# EAGLE design eye_of_horus_v1 (EAGLE 7.2.0)
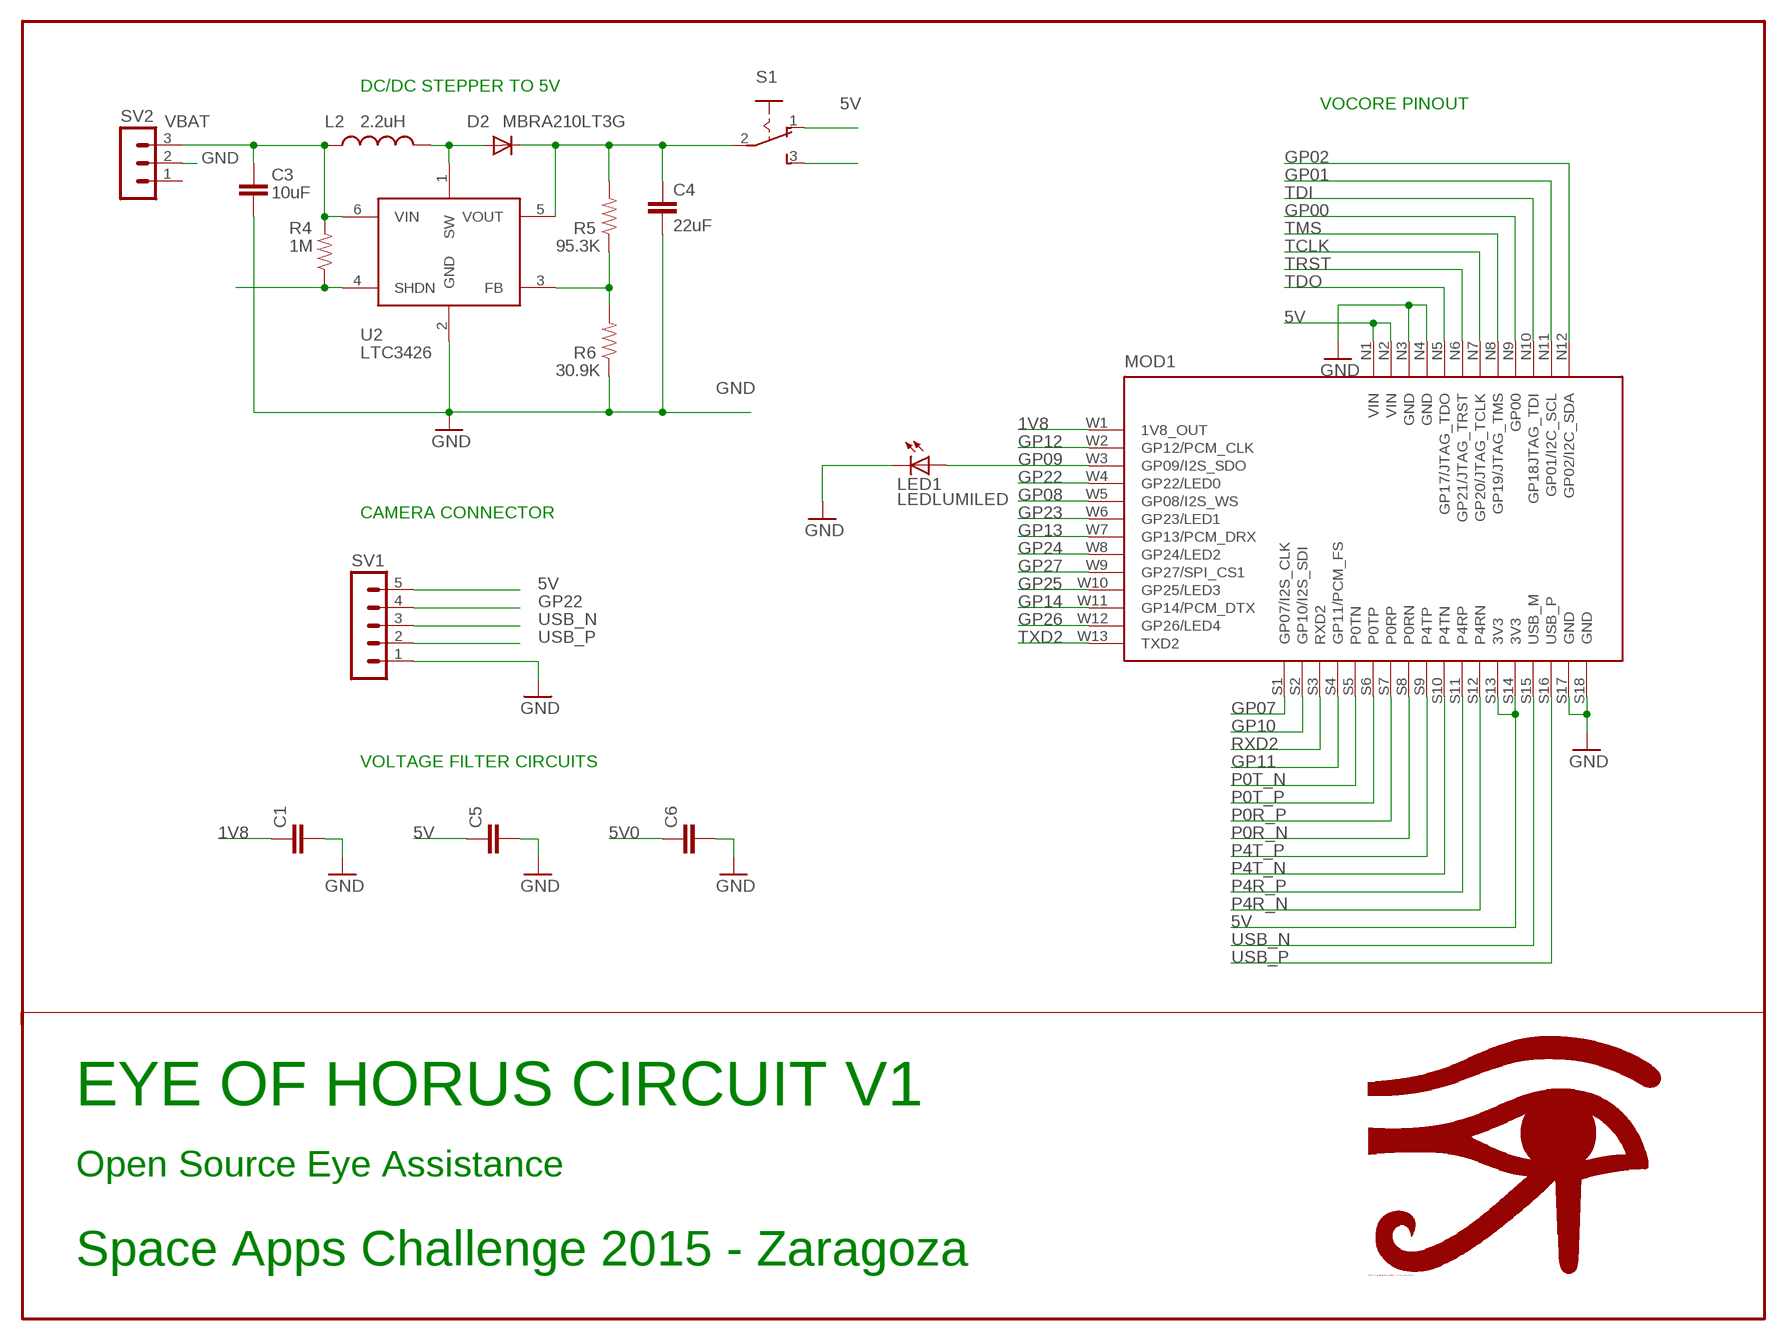
[diagram p0: schematic, sheet 1]

## Parts
C1  C-EUC0805  [C0805]
C3  10uF  CAP0603  [0603]
C4  22uF  CAP1206  [1206]
C5  C-EUC0805  [C0805]
C6  C-EUC0805  [C0805]
D2  MBRA210LT3G  DIODESMA  [SMA-DIODE]
L2  2.2uH  INDUCTOR1313  [1_3X1_3]
LED1  LEDLUMILED  [LUMILED]
MOD1  VOCORE_V10A  [VOCORE_V10A]
R4  1M  RESISTOR0603  [0603]
R5  95.3K  RESISTOR0603  [0603]
R6  30.9K  RESISTOR0603  [0603]
S1  255SB  [255SB]
SV1  MA05-1  [MA05-1]
SV2  MA03-1  [MA03-1]
U2  LTC3426  [SOT23-6]

## Nets
1V8: C1.1 MOD1.W1(1V8_OUT)
5V: C5.1 MOD1.N1(VIN) MOD1.N2(VIN) MOD1.S13(3V3) MOD1.S14(3V3) S1.1(O) SV1.5
5V0: C6.1
GND: C1.2 C3.2 C4.2 C5.2 C6.2 LED1.4-(C) MOD1.N3(GND) MOD1.N4(GND) MOD1.S17(GND) MOD1.S18(GND) R6.1 SV1.1 SV2.2 U2.2(GND)
GP00: MOD1.N9(GP00)
GP01: MOD1.N11(GP01/I2C_SCL)
GP02: MOD1.N12(GP02/I2C_SDA)
GP07: MOD1.S1(GP07/I2S_CLK)
GP08: MOD1.W5(GP08/I2S_WS)
GP09: LED1.2+(A) MOD1.W3(GP09/I2S_SDO)
GP10: MOD1.S2(GP10/I2S_SDI)
GP11: MOD1.S4(GP11/PCM_FS)
GP12: MOD1.W2(GP12/PCM_CLK)
GP13: MOD1.W7(GP13/PCM_DRX)
GP14: MOD1.W11(GP14/PCM_DTX)
GP22: MOD1.W4(GP22/LED0) SV1.4
GP23: MOD1.W6(GP23/LED1)
GP24: MOD1.W8(GP24/LED2)
GP25: MOD1.W10(GP25/LED3)
GP26: MOD1.W12(GP26/LED4)
GP27: MOD1.W9(GP27/SPI_CS1)
N$1: D2.A L2.P$2 U2.1(SW)
N$2: R4.1 U2.4(SHDN)
N$3: C4.1 D2.C R5.2 S1.2(P) U2.5(VOUT)
N$4: R5.1 R6.2 U2.3(FB)
N$6: S1.3(S)
P0R_N: MOD1.S8(P0RN)
P0R_P: MOD1.S7(P0RP)
P0T_N: MOD1.S5(P0TN)
P0T_P: MOD1.S6(P0TP)
P4R_N: MOD1.S12(P4RN)
P4R_P: MOD1.S11(P4RP)
P4T_N: MOD1.S10(P4TN)
P4T_P: MOD1.S9(P4TP)
RXD2: MOD1.S3(RXD2)
TCLK: MOD1.N7(GP20/JTAG_TCLK)
TDI: MOD1.N10(GP18JTAG_TDI)
TDO: MOD1.N5(GP17/JTAG_TDO)
TMS: MOD1.N8(GP19/JTAG_TMS)
TRST: MOD1.N6(GP21/JTAG_TRST)
TXD2: MOD1.W13(TXD2)
USB_N: MOD1.S15(USB_M) SV1.3
USB_P: MOD1.S16(USB_P) SV1.2
VBAT: C3.1 L2.P$1 R4.2 SV2.3 U2.6(VIN)
Unconnected: SV2.1

## Notes on the sheet
- DC/DC STEPPER TO 5V
- VOCORE PINOUT
- CAMERA CONNECTOR
- VOLTAGE FILTER CIRCUITS
- EYE OF HORUS CIRCUIT V1
- Open Source Eye Assistance
- Space Apps Challenge 2015 - Zaragoza
- C:/Users/Luis Martín/Desktop/Eye_of_horus_gold_(1).bmp

## Library data of the parts
C1 C5 C6 = rcl:C-EU: CAPACITOR, European symbol
C3 C4 = CH_passive:CAP: Capacitor Standard 0603 ceramic capacitor, and 0.1" leaded capacitor.
D2 = CH_semiconductors:DIODE: Diode These are standard reverse protection diodes and small signal diodes. SMA package can handle up to about 1A. SOD-323 can handle about 200mA. What the SOD-323 package when ordering, there are some mfgs out there that are 5-pin packages.
L2 = CH_passive:INDUCTOR: Inductors Basic Inductor/Choke - 0603 and 1206. Footprints are not proven and vary greatly between part numbers.
LED1 = led-lumiled:LED: LED - LUMILED® LXK2-PW12-R00, LXK2-PW12-S00, LXK2-PW14-U00, LXK2-PW14-V00 LXK2-PM12-R00, LXK2-PM12-S00, LXK2-PM14-U00 LXK2-PE12-Q00, LXK2-PE12-R00, LXK2-PE12-S00, LXK2-PE14-T00, LXK2-PE14-U00 LXK2-PB12-K00, LXK2-PB12-L00, LXK2-PB12-M00, LXK2-PB14-N00, LXK2-PB14-P00, LXK2-PB14-Q00 LXK2-PR12-L00, LXK2-PR12-M00, LXK2-PR14-Q00, LXK2-PR14-R00 LXK2-PD12-Q00, LXK2-PD12-R00, LXK2-PD12-S00 LXK2-PH12-R00, LXK2-PH12-S00 LXK2-PL12-P00, LXK2-PL12-Q00, LXK2-PL12-R00 Source: www.luxeon.com; OC_FARNELL: unknown; OC_NEWARK: unknown
MOD1 = vocore:VOCORE_V10A: VoCore module footprint, revision 1.0a Based on: http://vonger.cn/wp-content/uploads/2014/06/VoCore.v1.0a.pcb_.pdf Found a bug? Get in touch or send a pull request at https://github.com/omerk/vocore-evk
R4-R6 = CH_passive:RESISTOR: Resistor Basic schematic elements and footprints for 0603, 1206, and PTH 1/10th watt (small) resistors.
S1 = switch:255SB: SLIDING SWITCH Distributor Buerklin, 11G810
SV1 = con-lstb:MA05-1: PIN HEADER; OC_FARNELL: unknown; OC_NEWARK: unknown
SV2 = con-lstb:MA03-1: PIN HEADER; OC_FARNELL: unknown; OC_NEWARK: unknown
U2 = CH_Linear_technology:LTC3426

## Board
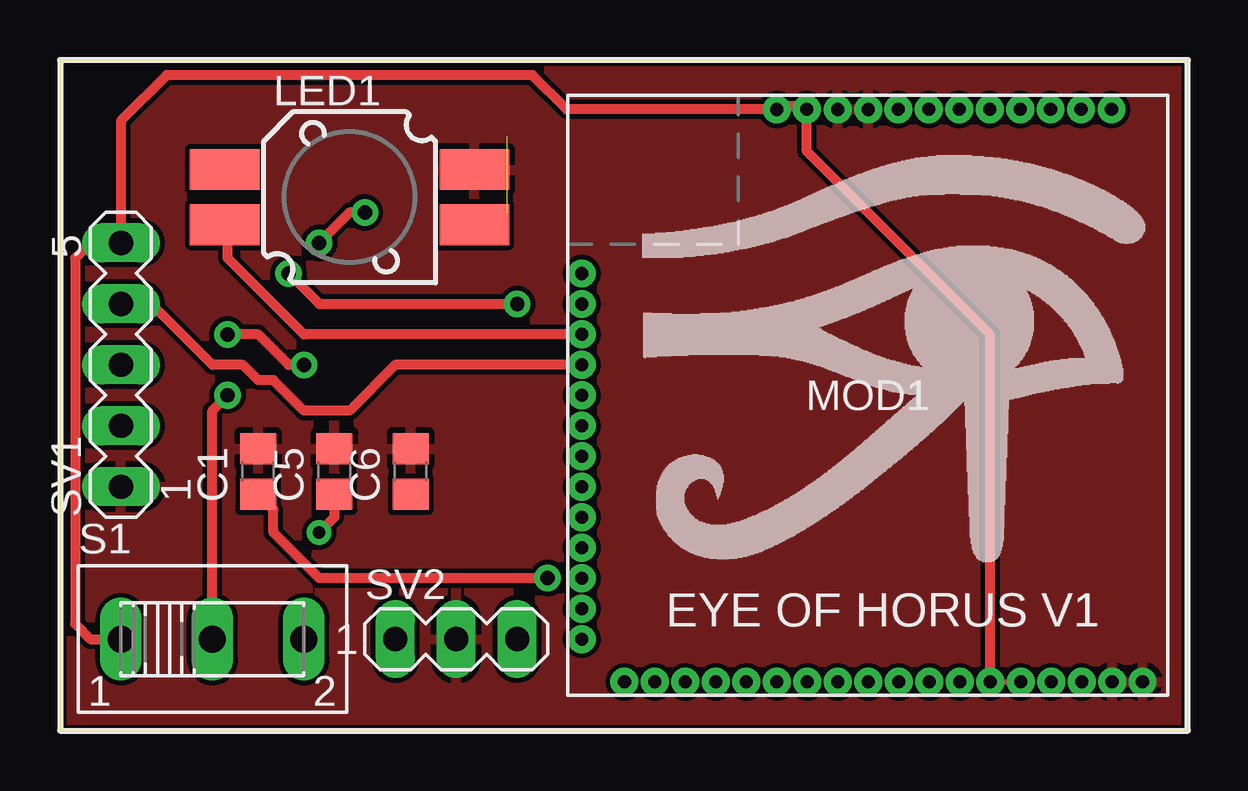
[diagram p1: board, top side]
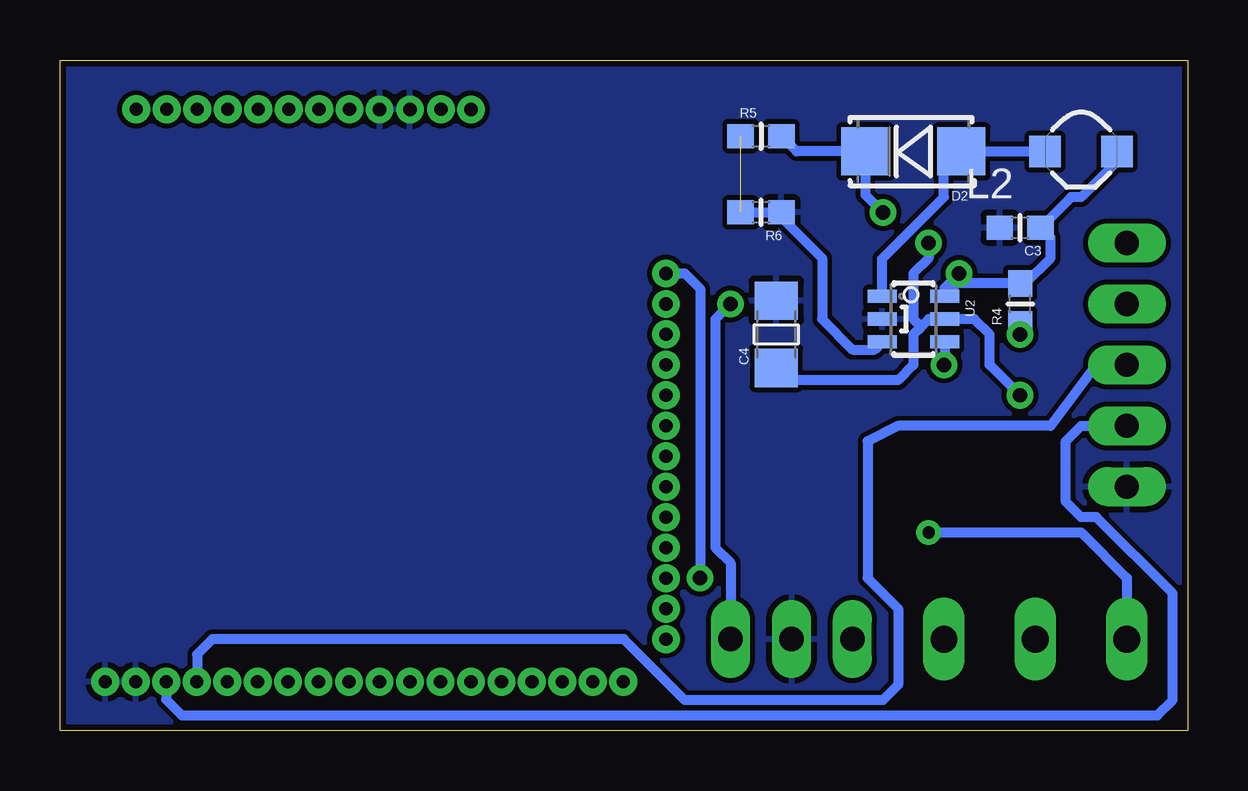
[diagram p2: board, bottom side, seen from below]

Size 46.99 x 27.94 mm. Coordinates in mm from the lower left corner, seen from the top.
Outline: 0,0 46.99,0 46.99,27.94 0,27.94 0,0
Copper layers (1*16): Top 0.035mm / dielectric 1.5mm / Bottom 0.035mm
Design rules "CHome": minimum track width 8mil, minimum drill 20mil, track to track 8mil, track to pad 8mil, pad to pad 8mil, via to via 8mil, smd to smd 8mil, copper to edge 10mil, drill to drill 8mil, minimum pad ring 12mil, minimum via ring 10mil, stop-mask expansion 4mil, vias tented up to drill 25mil, thermal gap 10mil

### Footprints (pad centres in the part's own frame; a part is rotated, then mirrored left to right if it is on the bottom)
C0805 = smd 1.3 x 1.5: 1 -0.95,0; 2 0.95,0
0603 = smd 1.1 x 1: 1 -0.85,0; 2 0.85,0
1206 = smd 1.6 x 1.8: 1 -1.4,0; 2 1.4,0
SMA-DIODE = smd 2 x 2: A -2,0; C 2,0
1_3X1_3 = smd 1.3 x 1.3: P$1 -1.5,0; P$2 1.5,0
LUMILED = smd 2.9 x 1.7: 1NC -5.2,1.15; 2+ -5.2,-1.15; 3NC 5.2,-1.15; 4- 5.2,1.15
VOCORE_V10A = drill 0.55 pad 0.906: N1 -3.788,11.909; N2 -2.541,11.912; N3 -1.248,11.909; N4 0.022,11.909; N5 1.269,11.912; N6 2.539,11.912; N7 3.809,11.912; N8 5.079,11.912; N9 6.349,11.912; N10 7.619,11.912; N11 8.889,11.912; N12 10.159,11.912; S1 -10.138,-11.941; S2 -8.868,-11.941; S3 -7.598,-11.941; S4 -6.328,-11.941; S5 -5.058,-11.941; S6 -3.788,-11.941; S7 -2.518,-11.941; S8 -1.248,-11.941; S9 0.022,-11.941; S10 1.292,-11.941; S11 2.562,-11.941; S12 3.832,-11.941; S13 5.102,-11.941; S14 6.372,-11.941; S15 7.642,-11.941; S16 8.912,-11.941; S17 10.182,-11.941; S18 11.452,-11.941; W1 -11.916,5.077; W2 -11.916,3.807; W3 -11.916,2.537; W4 -11.916,1.267; W5 -11.916,-0.003; W6 -11.916,-1.273; W7 -11.916,-2.543; W8 -11.916,-3.813; W9 -11.916,-5.083; W10 -11.916,-6.353; W11 -11.916,-7.623; W12 -11.916,-8.893; W13 -11.916,-10.163
255SB = drill 1.118 long: 1 -3.81,0; 2 0,0; 3 3.81,0
MA05-1 = drill 1.016 long: 1 -5.08,0; 2 -2.54,0; 3 0,0; 4 2.54,0; 5 5.08,0
MA03-1 = drill 1.016 long: 1 -2.54,0; 2 0,0; 3 2.54,0
SOT23-6 = smd 0.55 x 1.2: 1 -0.95,-1.3; 2 0,-1.3; 3 0.95,-1.3; 4 0.95,1.3; 5 0,1.3; 6 -0.95,1.3

### Placement (x,y rotation side)
C1  8.26,10.79 90 top
C3  6.98,20.96 180 bottom
C4  17.15,16.51 90 bottom
C5  11.43,10.79 90 top
C6  14.61,10.79 90 top
D2  11.43,24.13 180 bottom
L2  4.45,24.13 180 bottom
LED1  12.07,22.22 0 top
MOD1  33.66,13.97 0 top
R4  6.98,17.78 90 bottom
R5  17.78,24.77 0 bottom
R6  17.78,21.59 180 bottom
S1  6.35,3.81 0 top
SV1  2.54,15.24 90 top
SV2  16.51,3.81 0 top
U2  11.43,17.14 270 bottom

### Tracks (layer width: path | path; a pad name or v marks a point on that pad's centre or on a via)
1V8  (via drill 0.6)
  Top 0.406: v20.32,6.35 10.8,6.35 8.89,8.25 8.89,9.21 C1.1
  Bottom 0.406: MOD1.W1 20.95,19.05 20.32,18.41 v20.32,6.35
5V  (via drill 0.51)
  Top 0.203: MOD1.S13 MOD1.S14
  Top 0.406: S1.1 1.27,3.81 0.64,4.44 0.64,19.68 1.27,20.32 SV1.5 2.54,25.4 4.45,27.3 19.69,27.3 21.11,25.88 MOD1.N1 29.85,25.88 29.85,26.03 31.11,26.03 MOD1.N2 31.12,24.13 38.76,16.49 MOD1.S13 | C5.1 11.43,8.89 v10.8,8.25
  Bottom 0.406: v10.8,8.25 4.45,8.25 2.54,6.35 S1.1
GND
  pour Bottom: -0.63,28.57 -0.63,-0.63 47.63,-0.63 47.63,28.57
  pour Top: -0.63,-0.63 47.63,-0.63 47.63,28.57 -0.63,28.57
GP09
  Top 0.406: MOD1.W3 10.16,16.51 6.98,19.68 6.98,20.95 LED1.2+
GP22
  Top 0.406: MOD1.W4 13.97,15.24 12.07,13.33 10.16,13.33 8.89,14.6 8.26,14.6 7.62,15.24 6.35,15.24 3.81,17.78 SV1.4
N$1
  Bottom 0.406: U2.1 12.73,19.65 10.16,22.22 10.16,23.4 D2.A L2.P$2
N$2  (via drill 0.6)
  Top 0.406: v10.16,15.24 9.53,15.24 8.26,16.51 v6.98,16.51
  Bottom 0.406: U2.4 10.13,15.27 v10.16,15.24 | v6.98,16.51 R4.1
N$3  (via drill 0.6)
  Top 0.406: S1.2 6.35,13.33 v6.98,13.97 | v12.7,21.59 12.07,21.59 v10.8,20.32
  Bottom 0.406: v6.98,13.97 8.26,15.24 8.26,16.51 8.89,17.14 U2.5 10.8,17.14 11.11,16.83 | 11.11,16.83 11.43,16.51 11.43,15.24 12.07,14.6 16.64,14.6 C4.1 | R5.2 16.3,24.13 D2.C 13.43,22.32 v12.7,21.59 | v10.8,20.32 10.8,19.68 11.43,19.05 11.43,17.14 11.11,16.83
N$4  (1 unrouted)
  Bottom 0.406: R6.2 17.15,21.59 15.24,19.68 15.24,17.14 13.97,15.87 13.05,15.87 U2.3
USB_N
  Bottom 0.406: SV1.3 3.81,15.24 5.72,12.7 12.07,12.7 13.34,12.06 13.34,6.35 12.07,5.08 12.07,1.9 12.7,1.27 20.96,1.27 23.49,3.81 40.64,3.81 41.27,3.17 41.27,2.05 MOD1.S15
USB_P
  Bottom 0.406: MOD1.S16 42.57,1.29 41.91,0.63 1.27,0.63 0.64,1.27 0.64,5.71 3.81,8.89 4.45,8.89 5.08,9.52 5.08,12.06 4.45,12.7 SV1.2
VBAT  (via drill 0.6)
  Top 0.406: v9.53,19.05 10.8,17.78 v19.05,17.78
  Bottom 0.406: L2.P$1 2.95,23.72 4.45,22.22 4.87,22.22 C3.1 5.72,20.53 5.72,19.68 6.77,18.63 R4.2 9.6,18.63 U2.6 10.13,18.44 v9.53,19.05 | v19.05,17.78 19.69,17.14 19.69,7.62 19.05,6.98 SV2.3

### Text on the board
tPlace: EYE OF HORUS V1
_tsilk: C@Home | Aug.5,09 | Vin | Gnd | 1M | 10u | Sh | 22u | Gn | Vout | 95.3K | r1.0